# EAGLE design Activation (EAGLE 9.3.0)
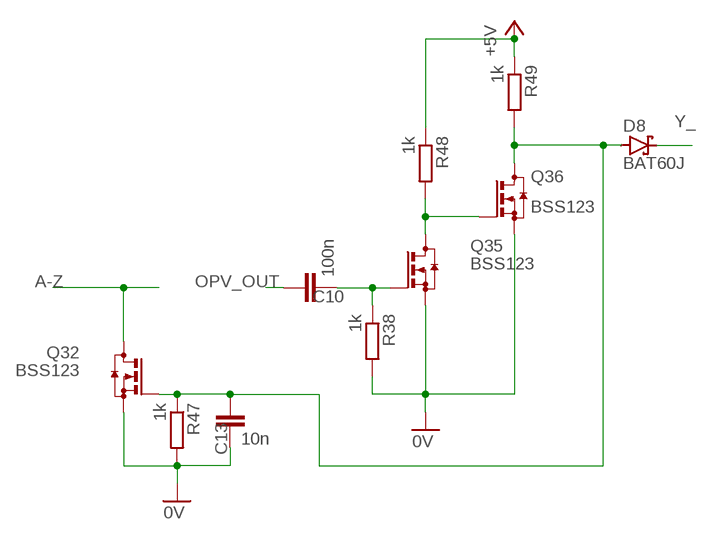
[diagram p0: schematic, sheet 1]

## Parts
C10  100n  C-EUC0805  [C0805]
C13  10n  C-EUC0805  [C0805]
D8  BAT60J  [SOD323_ST]
Q32  BSS123  [SOT23]
Q35  BSS123  [SOT23]
Q36  BSS123  [SOT23]
R38  1k  R-EU_M0805  [M0805]
R47  1k  R-EU_M0805  [M0805]
R48  1k  R-EU_M0805  [M0805]
R49  1k  R-EU_M0805  [M0805]

## Nets
0V: C13.2 Q32.2(S) Q35.2(S) Q36.2(S) R38.2 R47.2
+5V: R48.1 R49.1
A-Z: Q32.3(D)
N$3: C10.2 Q35.1(G) R38.1
N$5: Q35.3(D) Q36.1(G) R48.2
N$16: C13.1 D8.A Q32.1(G) Q36.3(D) R47.1 R49.2
OPV_OUT: C10.1
Y_: D8.C

## Library data of the parts
C10 C13 = rcl:C-EU: CAPACITOR, European symbol; SPICEPREFIX: C
D8 = diode:BAT60J: Schottky barrier diode Source: www.st.com, BAT60J.pdf
Q32 Q35 Q36 = transistor-small-signal:BSS123: N-CHANNEL MOS FET
R38 R47-R49 = rcl:R-EU_: RESISTOR, European symbol; SPICEPREFIX: R

## Board
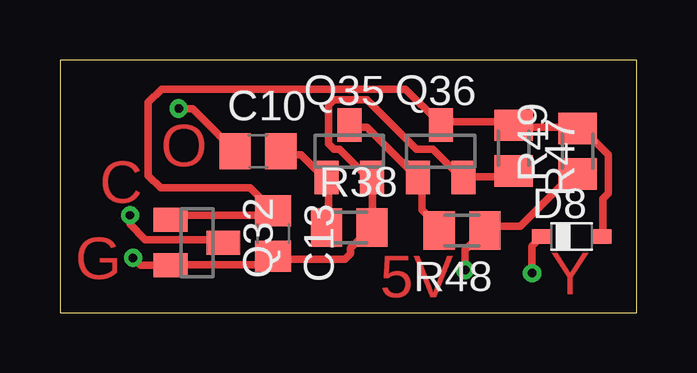
[diagram p1: board, top side]

Size 24.05 x 10.53 mm. Coordinates in mm from the lower left corner, seen from the top.
Outline: 0,0 24.05,0 24.05,10.53 0,10.53 0,0
Copper layers (1*16): Top 0.035mm / dielectric 1.5mm / Bottom 0.035mm
Design rules "default *": minimum track width 12mil, minimum drill 0.35mm, track to track 6mil, track to pad 6mil, pad to pad 6mil, via to via 6mil, smd to smd 6mil, copper to edge 40mil, drill to drill 6mil, minimum pad ring 10mil, minimum via ring 8mil, stop-mask expansion 4mil, vias tented up to drill 0mil, thermal gap 10mil

### Footprints (pad centres in the part's own frame; a part is rotated, then mirrored left to right if it is on the bottom)
C0805 = smd 1.3 x 1.5: 1 -0.95,0; 2 0.95,0
SOD323_ST = smd 0.8 x 0.6: A 1.25,0; C -1.25,0
SOT23 = smd 1 x 1.4: 1 -0.95,-1.1; 2 0.95,-1.1; 3 0,1.1
M0805 = smd 1.3 x 1.6: 1 -0.95,0; 2 0.95,0

### Placement (x,y rotation side)
C10  8.26,6.73 0 top
C13  8.89,3.3 270 top
D8  21.34,3.17 0 top
Q32  5.71,2.92 270 top
Q35  12.06,6.73 0 top
Q36  15.88,6.73 0 top
R38  12.06,3.56 0 top
R47  18.92,6.86 270 top
R48  16.76,3.43 180 top
R49  21.59,6.73 90 top

### Tracks (layer width: path | path; a pad name or v marks a point on that pad's centre or on a via)
0V  (via drill 0.35)
  Top 0.305: R47.2 18.75,5.89 18.52,5.66 16.92,5.66 Q36.2 16.69,5.66 15.54,6.81 14.86,6.81 12.8,8.87 11.43,8.87 11.2,8.64 11.2,7.04 11.43,6.81 11.66,6.81 12.8,5.66 Q35.2 13.03,5.44 13.03,3.61 R38.2 12.8,3.38 12.12,2.69 12.12,2.46 11.89,2.23 8.91,2.23 C13.2 8.69,2.23 8.46,2.01 4.8,2.01 Q32.2 3.36,1.97 v3.05,2.29
+5V  (via drill 0.35)
  Top 0.305: R49.1 21.49,5.89 19.2,3.61 17.83,3.61 R48.1 16.89,2.61 v16.89,1.78
A-Z  (via drill 0.35)
  Top 0.305: Q32.3 6.69,3.05 3.56,3.05 2.92,3.68 v2.92,4.06
N$3
  Top 0.305: R38.1 11.2,3.61 11.2,5.44 Q35.1 10.97,5.66 10.06,6.58 9.37,6.58 C10.2
N$5
  Top 0.305: R48.2 15.77,3.61 15.09,4.29 15.09,5.44 Q36.1 14.86,5.66 12.8,7.72 12.12,7.72 Q35.3
N$16
  Top 0.305: Q32.1 4.8,4.06 8.69,4.06 C13.1 7.93,5.21 4.19,5.21 3.68,5.71 3.68,8.76 4.24,9.32 14.4,9.32 15.77,7.95 Q36.3 16,7.95 18.75,7.95 R47.1 18.97,7.72 21.49,7.72 R49.2 21.72,7.72 22.86,6.58 22.86,4.98 22.63,4.75 22.63,3.38 D8.A
OPV_OUT  (via drill 0.35)
  Top 0.305: C10.1 5.53,8.51 v4.95,8.51
Y_  (via drill 0.35)
  Top 0.305: D8.C 19.68,2.77 v19.68,1.65

### Text on the board
Top: O | C | G | 5V | Y